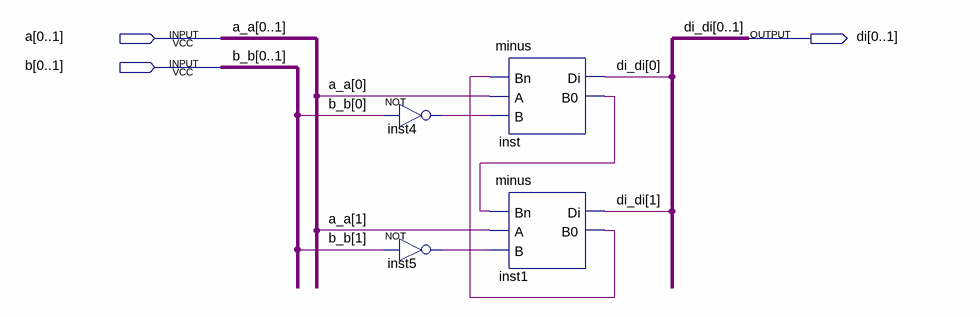
[diagram p0: schematic sheet]
// Quartus schematic cascade.bdf as structural Verilog: 4 symbols, 3 pins
module cascade (
  input  [0:1] a,
  input  [0:1] b,
  output [0:1] di
);

  wire inst1_b0, inst_b0, undriven, undriven_2;

  not inst4 (b[0], undriven);
  not inst5 (b[1], undriven_2);
  minus inst (.Bn(inst1_b0), .A(a[0]), .B(b[0]), .Di(di[0]), .B0(inst_b0));
  minus inst1 (.Bn(inst_b0), .A(a[1]), .B(b[1]), .Di(di[1]), .B0(inst1_b0));

  // Other names for the same wires on the sheet: a_a[1:0] = {a[1], a[0]}; b_b[1:0] = {b[1], b[0]};
  //   di_di[1:0] = {di[1], di[0]}
endmodule
